# Altium schematic sheet H_Bridge.SchDoc
size A3; SheetNumber: 5; SheetTotal: 9
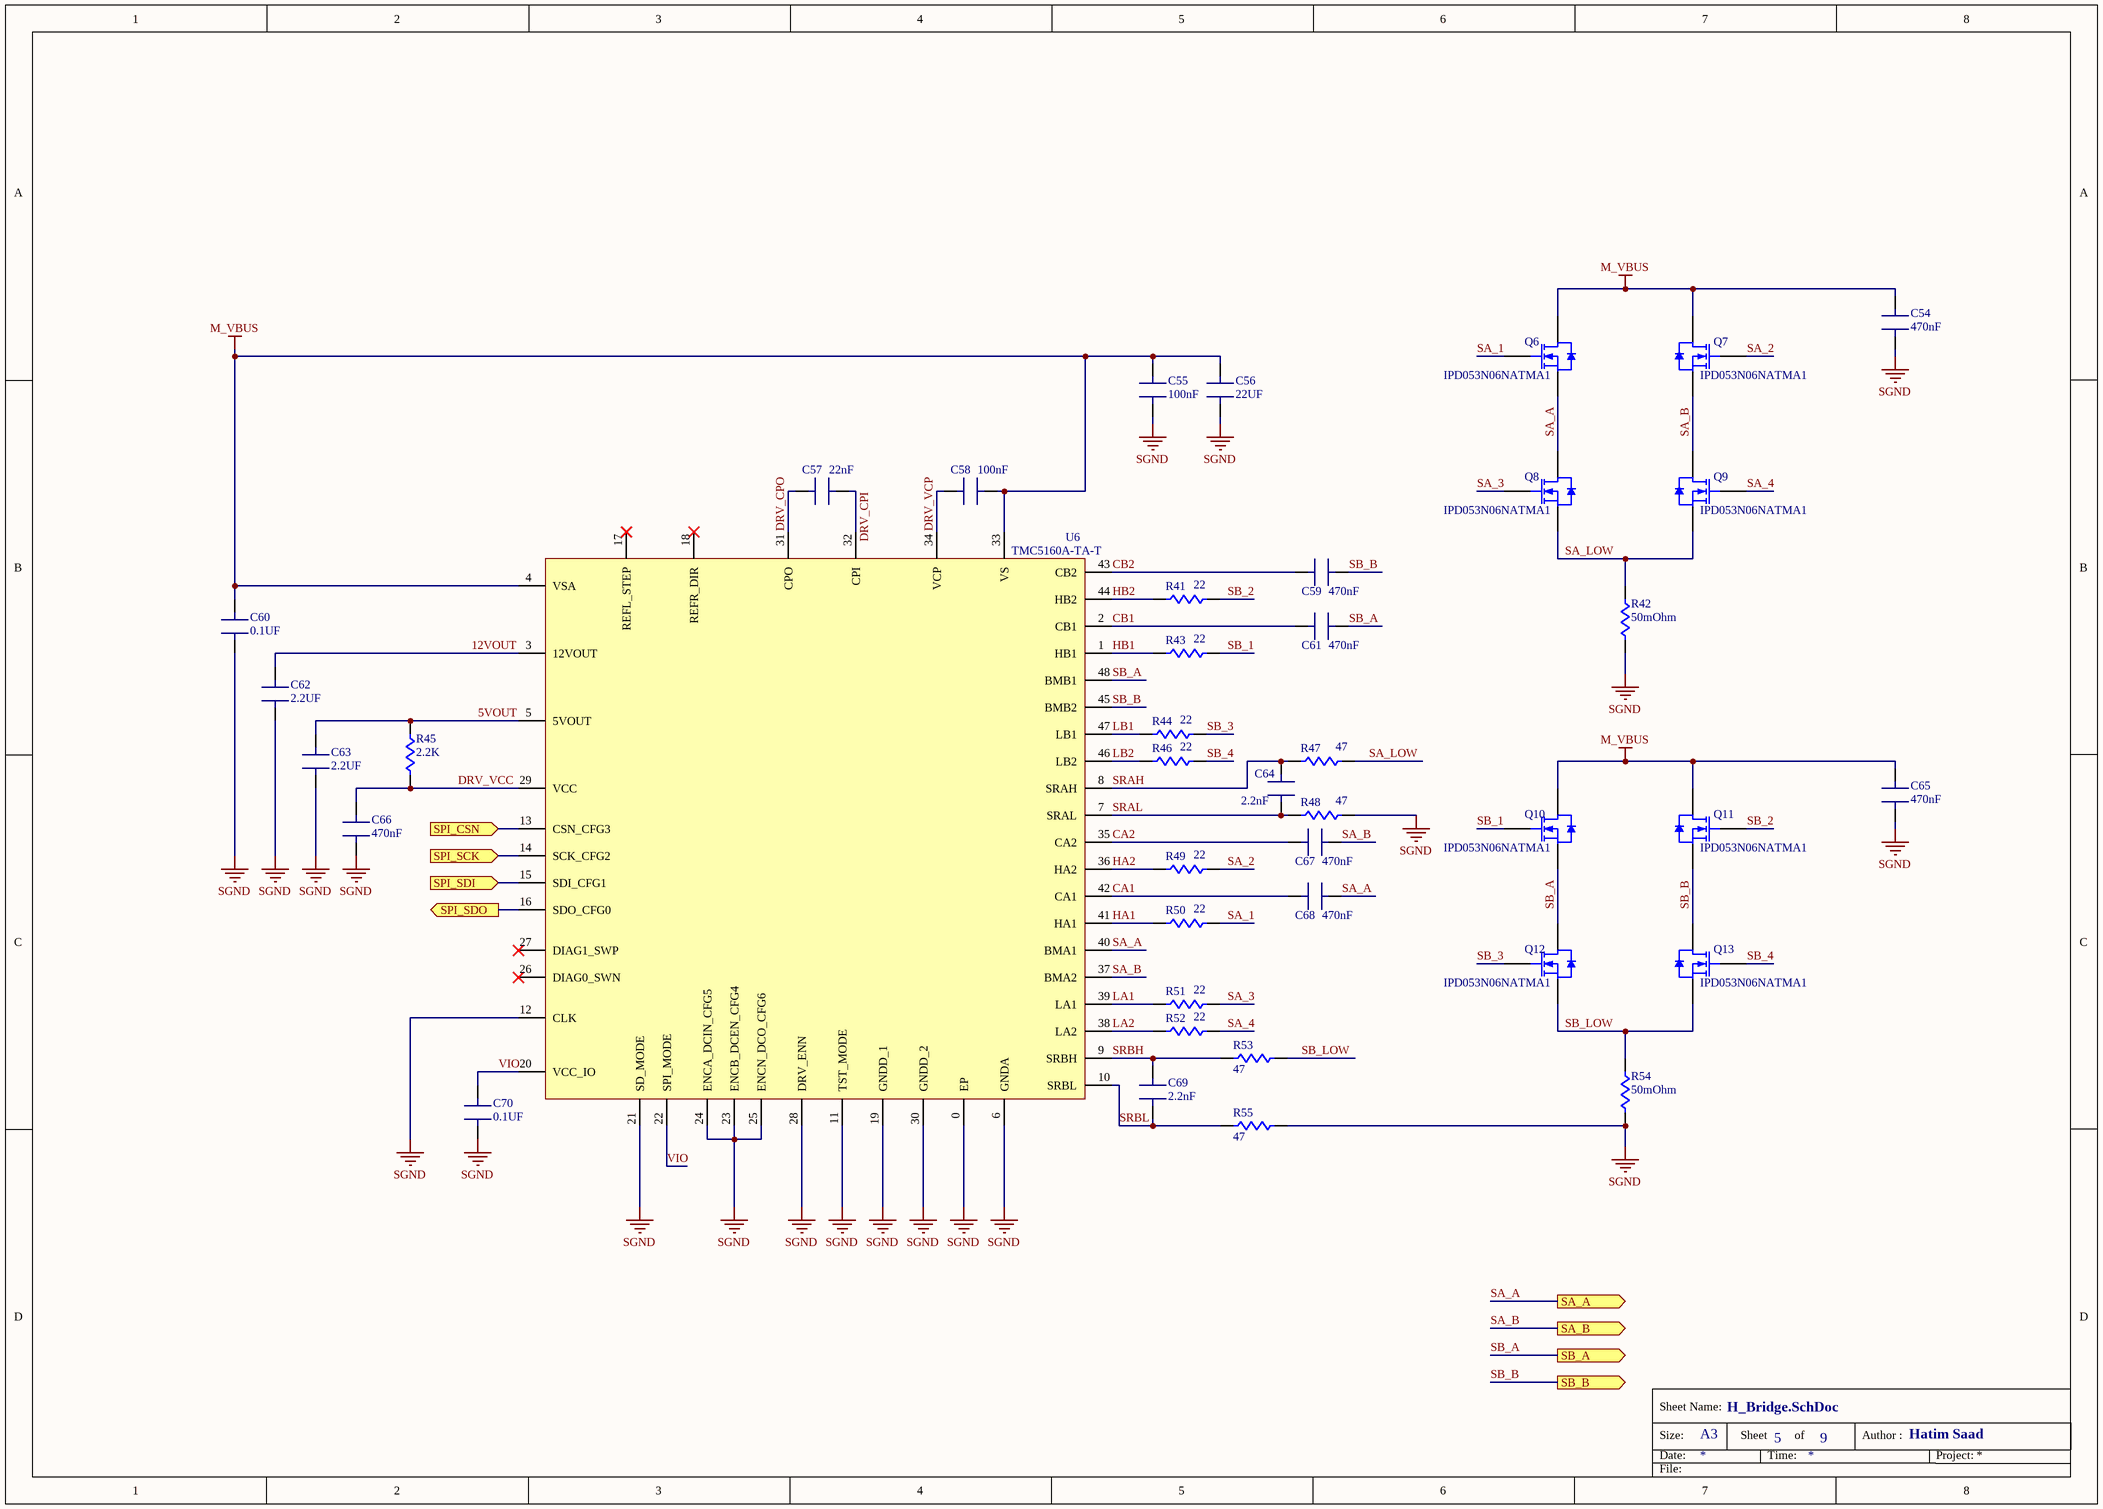
[diagram p0: H_Bridge.SchDoc]

## Parts
C54  470nF  [CAP: 0805]
C55  100nF  [CAP: 0805]
C56  22UF  [CAP: 0805]
C57  22nF  [CAP: 0805]
C58  100nF  [CAP: 0805]
C59  470nF  [CAP: 0805]
C60  0.1UF  [CAP: 0603]
C61  470nF  [CAP: 0805]
C62  2.2UF  [CAP: 0603]
C63  2.2UF  [CAP: 0603]
C64  2.2nF  [CAP: 0603]
C65  470nF  [CAP: 0805]
C66  470nF  [CAP: 0603]
C67  470nF  [CAP: 0805]
C68  470nF  [CAP: 0805]
C69  2.2nF  [CAP: 0603]
C70  0.1UF  [CAP: 0603]
Q6  IPD053N06NATMA1  [DPAK_3]
Q7  IPD053N06NATMA1  [DPAK_3]
Q8  IPD053N06NATMA1  [DPAK_3]
Q9  IPD053N06NATMA1  [DPAK_3]
Q10  IPD053N06NATMA1  [DPAK_3]
Q11  IPD053N06NATMA1  [DPAK_3]
Q12  IPD053N06NATMA1  [DPAK_3]
Q13  IPD053N06NATMA1  [DPAK_3]
R41  22  [RES: 0603]
R42  50mOhm  [RES: 2512]
R43  22  [RES: 0603]
R44  22  [RES: 0603]
R45  2.2K  [RES: 0603]
R46  22  [RES: 0603]
R47  47  [RES: 0603]
R48  47  [RES: 0603]
R49  22  [RES: 0603]
R50  22  [RES: 0603]
R51  22  [RES: 0603]
R52  22  [RES: 0603]
R53  47  [RES: 0603]
R54  50mOhm  [RES: 2512]
R55  47  [RES: 0603]
U6  TMC5160A-TA-T  [48-TQFP]

## Ports
SA_A (out), SA_B (out), SB_A (out), SB_B (out), SPI_CSN (in), SPI_SCK (in), SPI_SDI (in), SPI_SDO (out)

## Nets
M_VBUS: C54.2(B) C55.2(B) C56.1(A) C58.2(B) C60.2(B) C65.2(B) Q6.4(D) Q7.4(D) Q10.4(D) Q11.4(D) U6.4(VSA) U6.33(VS)
SGND: C54.1(A) C55.1(A) C56.2(B) C60.1(A) C62.1(A) C63.1(A) C65.1(A) C66.1(A) C70.1(A) R42.1 R48.1 R54.1 R55.1 U6.0(EP) U6.6(GNDA) U6.11(TST_MODE) U6.12(CLK) U6.19(GNDD_1) U6.21(SD_MODE) U6.23(ENCB_DCEN_CFG4) U6.24(ENCA_DCIN_CFG5) U6.25(ENCN_DCO_CFG6) U6.28(DRV_ENN) U6.30(GNDD_2)
5VOUT: C63.2(B) R45.2 U6.5(5VOUT)
12VOUT: C62.2(B) U6.3(12VOUT)
CA1: C68.1(A) U6.42(CA1)
CA2: C67.1(A) U6.35(CA2)
CB1: C61.1(A) U6.2(CB1)
CB2: C59.1(A) U6.43(CB2)
DRV_CPI: C57.2(B) U6.32(CPI)
DRV_CPO: C57.1(A) U6.31(CPO)
DRV_VCC: C66.2(B) R45.1 U6.29(VCC)
DRV_VCP: C58.1(A) U6.34(VCP)
HA1: R50.2 U6.41(HA1)
HA2: R49.2 U6.36(HA2)
HB1: R43.2 U6.1(HB1)
HB2: R41.2 U6.44(HB2)
LA1: R51.2 U6.39(LA1)
LA2: R52.2 U6.38(LA2)
LB1: R44.2 U6.47(LB1)
LB2: R46.2 U6.46(LB2)
SA_1: Q6.1(G) R50.1
SA_2: Q7.1(G) R49.1
SA_3: Q8.1(G) R51.1
SA_4: Q9.1(G) R52.1
SA_A: C68.2(B) Q6.3(S) Q8.4(D) U6.40(BMA1) ; port SA_A
SA_B: C67.2(B) Q7.3(S) Q9.4(D) U6.37(BMA2) ; port SA_B
SA_LOW: Q8.3(S) Q9.3(S) R42.2 R47.1
SB_1: Q10.1(G) R43.1
SB_2: Q11.1(G) R41.1
SB_3: Q12.1(G) R44.1
SB_4: Q13.1(G) R46.1
SB_A: C61.2(B) Q10.3(S) Q12.4(D) U6.48(BMB1) ; port SB_A
SB_B: C59.2(B) Q11.3(S) Q13.4(D) U6.45(BMB2) ; port SB_B
SB_LOW: Q12.3(S) Q13.3(S) R53.1 R54.2
SPI_CSN: U6.13(CSN_CFG3) ; port SPI_CSN
SPI_SCK: U6.14(SCK_CFG2) ; port SPI_SCK
SPI_SDI: U6.15(SDI_CFG1) ; port SPI_SDI
SPI_SDO: U6.16(SDO_CFG0) ; port SPI_SDO
SRAH: C64.2(B) R47.2 U6.8(SRAH)
SRAL: C64.1(A) R48.2 U6.7(SRAL)
SRBH: C69.2(B) R53.2 U6.9(SRBH)
SRBL: C69.1(A) R55.2 U6.10(SRBL)
VIO: C70.2(B) U6.20(VCC_IO) U6.22(SPI_MODE)

Not connected (* = marked no-connect by the designer): U6 17(REFL_STEP)* 18(REFR_DIR)* 26(DIAG0_SWN)* 27(DIAG1_SWP)*

## Notes on the sheet
- Size:
- Date:
- Sheet Name:
- A3
- Sheet
- Time:
- of
- Author :
- Hatim Saad
- Project:
- File:

## Library data of the parts
C54-C59 C61 C65 C67 C68 = CAP 0805: CAP SMD 0805
C60 C62-C64 C66 C69 C70 = CAP 0603: CAP SMD 0603
Q6-Q13 = IPD053N06NATMA1: MOSFETs N-Ch 60V 45A DPAK-2; Supplier 1: Mouser; Supplier Part Number 1: 726-IPD053N06NATMA1
R41 R43-R53 R55 = RES 0603: RES SMD 0603
R42 R54 = TLRP3A20WR050FTE: Current Sense Resistors - SMD TLRP 2512 2.0W R050 1% 75PPM 4K RL; Supplier 1: Mouser; Supplier Part Number 1: 279-TLRP3A20WR050FTE
U6 = TMC5160A-TA-T: Motor/Motion/Ignition Controllers & Drivers Stepper motor cDriver 8 to 60V, for external N-Fets with S/D and SPI Interface, 256 Steps, SixPoint ramp controller, CoolStep, StallGuard2, SpreadCycle and StealthChop2; Supplier 1: Mouser; Supplier Part Number 1: 700-TMC5160A-TA-T